# Altium schematic sheet 0160_PCH RAILS.SchDoc
size 848 x 558 mm
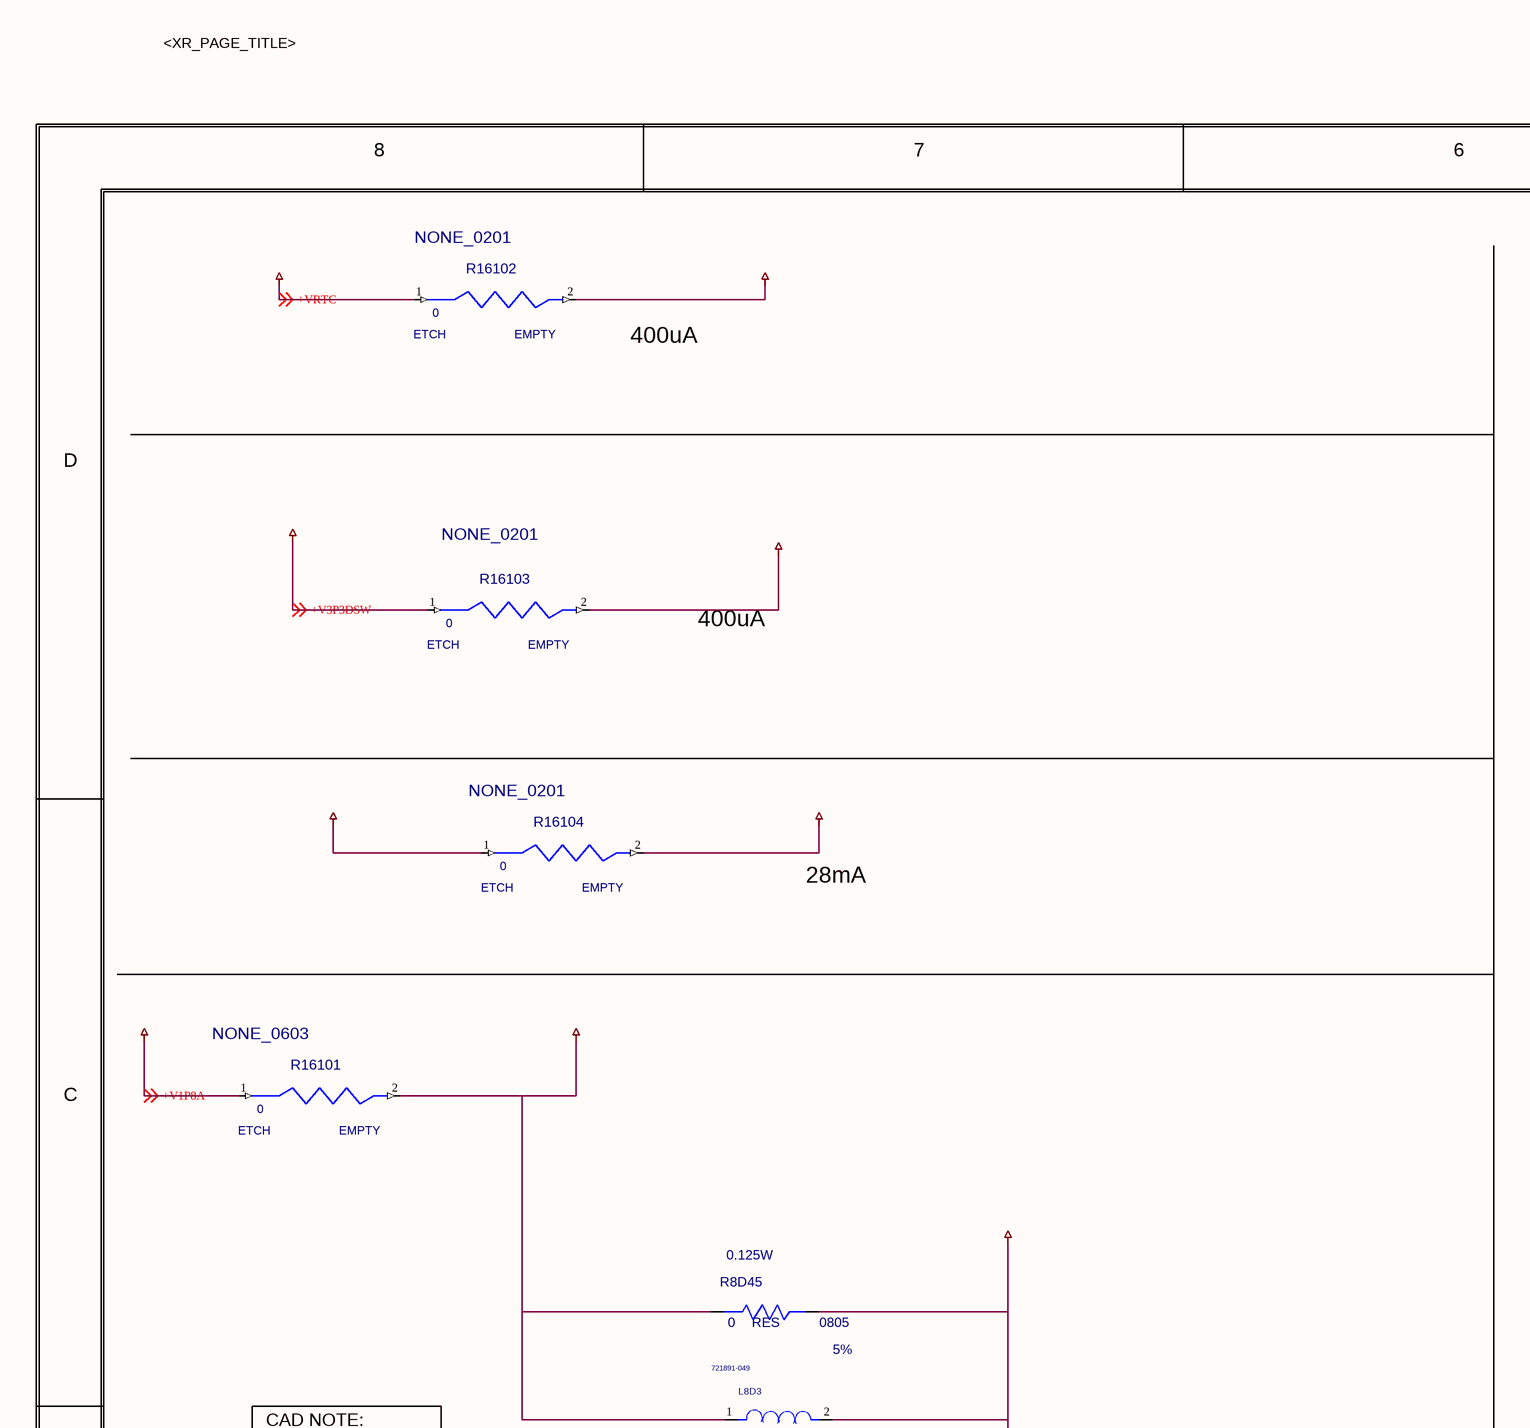
[diagram p0: 0160_PCH RAILS.SchDoc, top left]
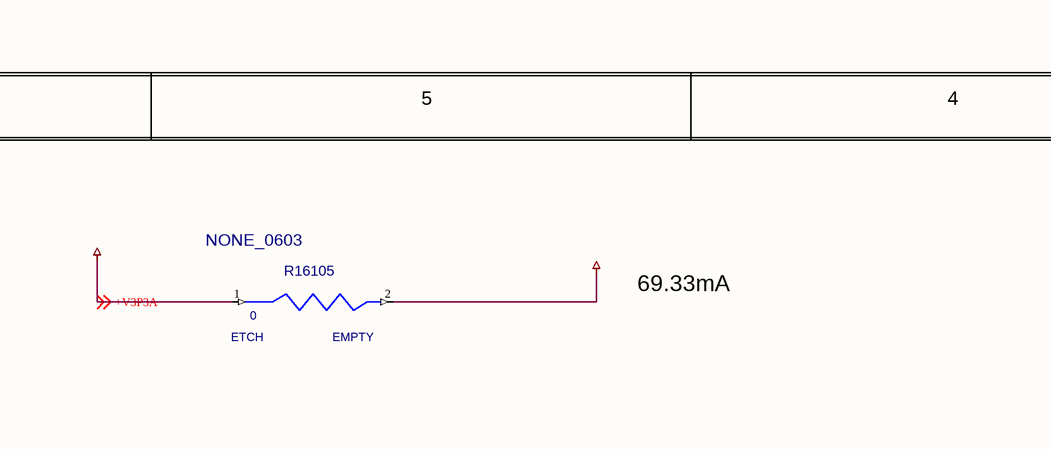
[diagram p1: 0160_PCH RAILS.SchDoc, top middle]
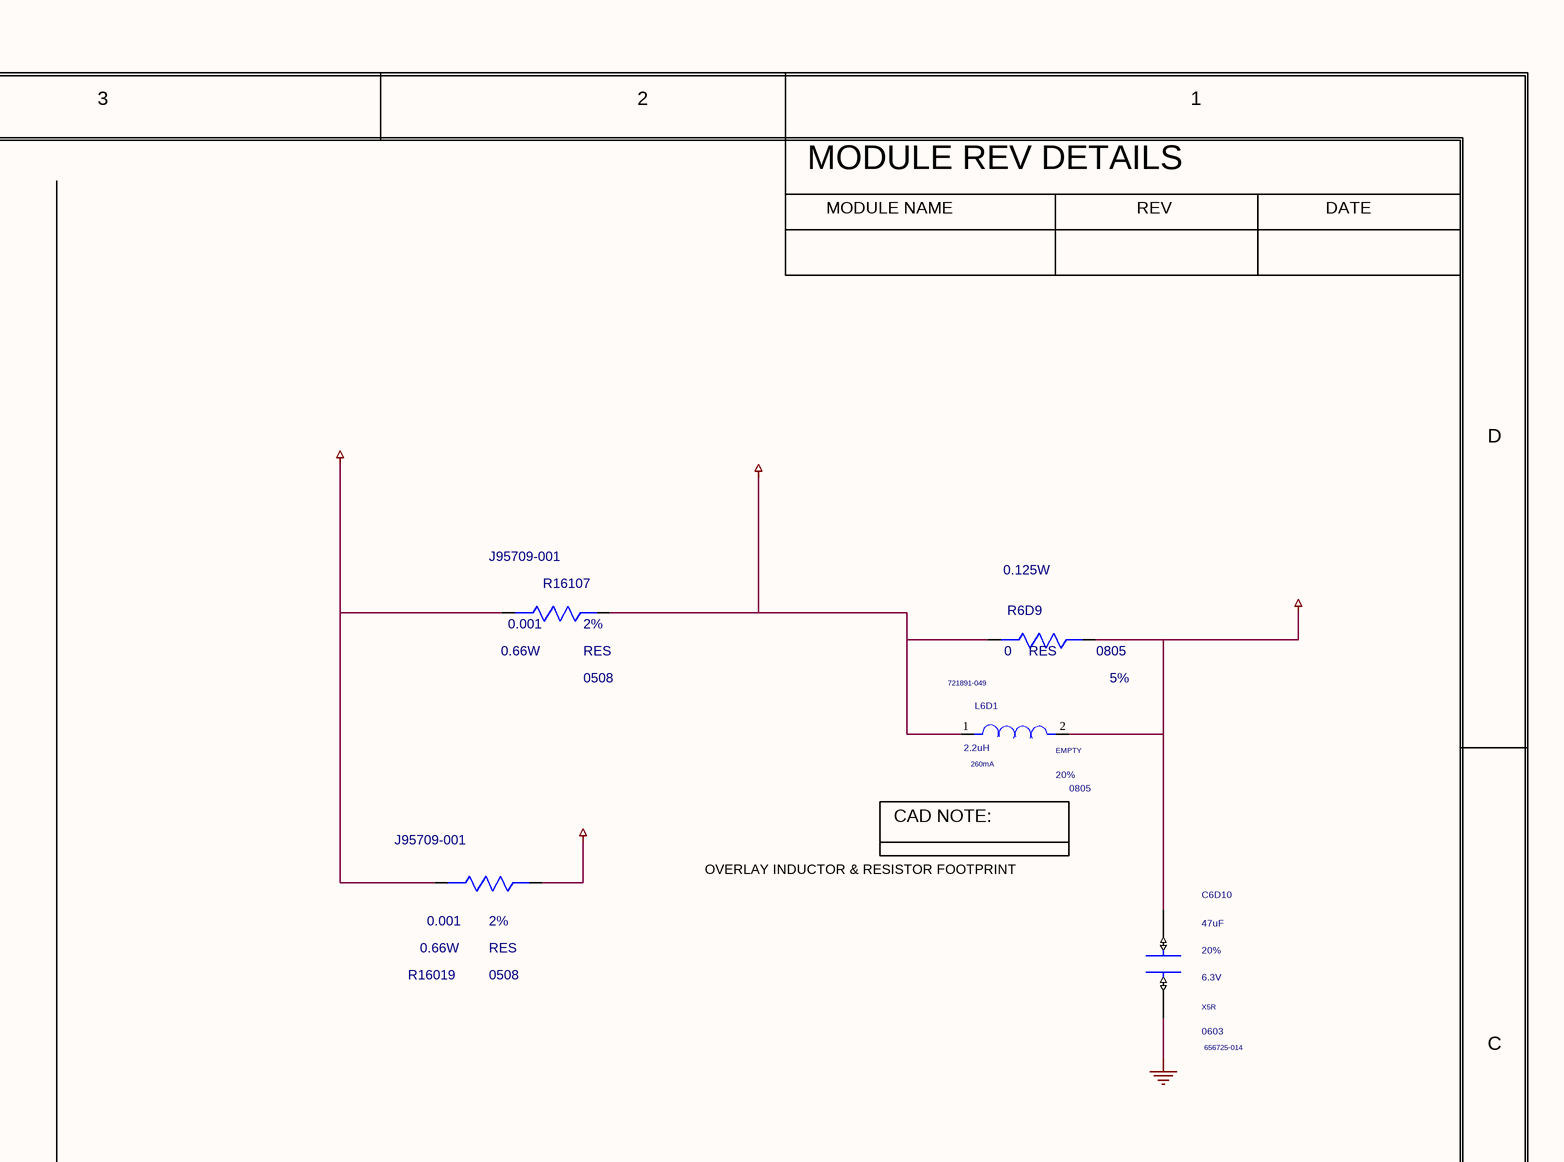
[diagram p2: 0160_PCH RAILS.SchDoc, top right]
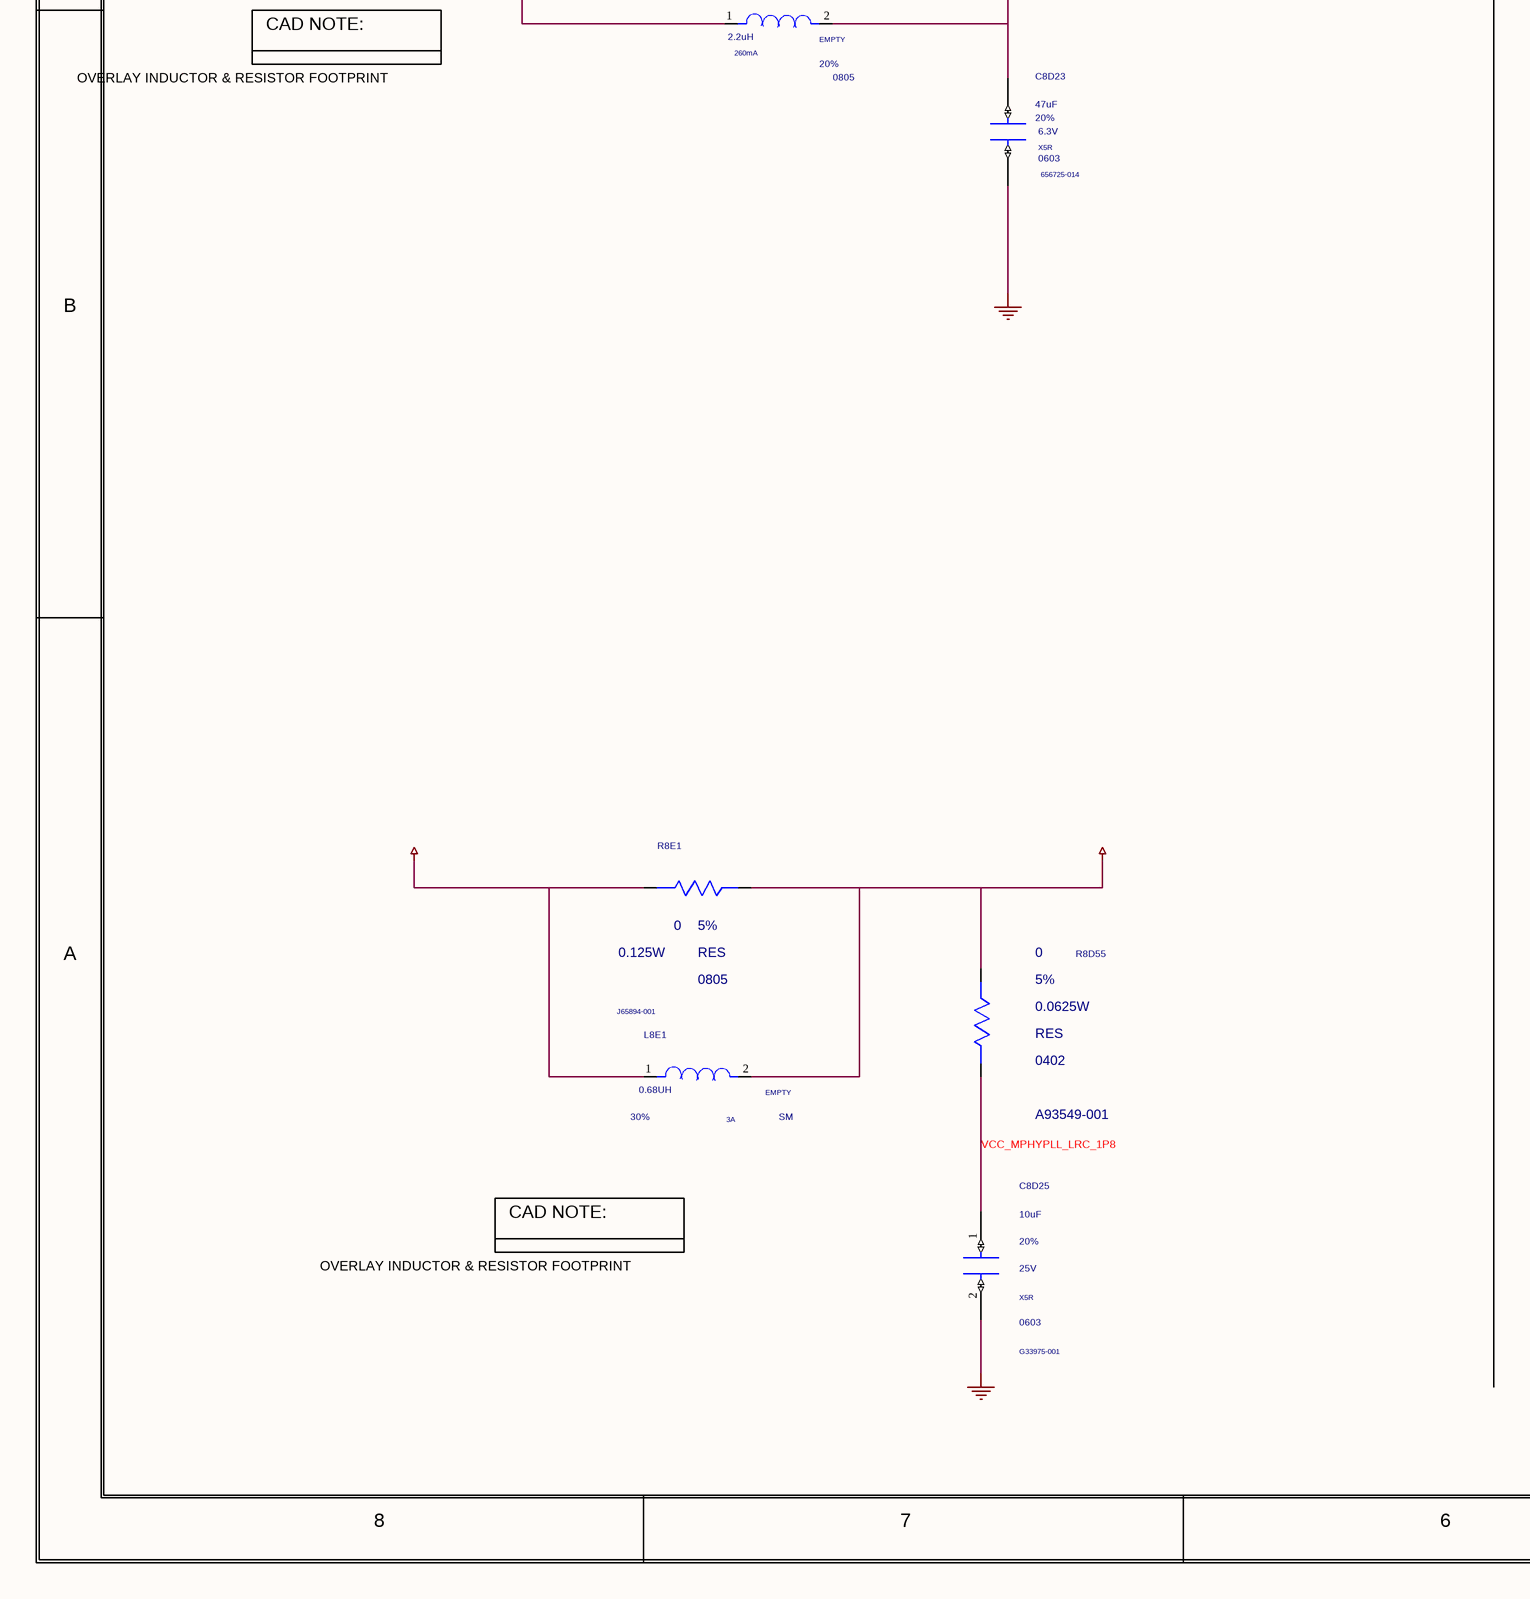
[diagram p3: 0160_PCH RAILS.SchDoc, bottom left]
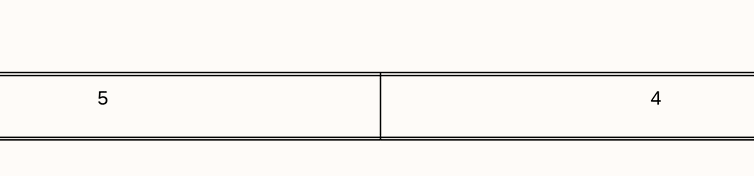
[diagram p4: 0160_PCH RAILS.SchDoc, bottom middle]
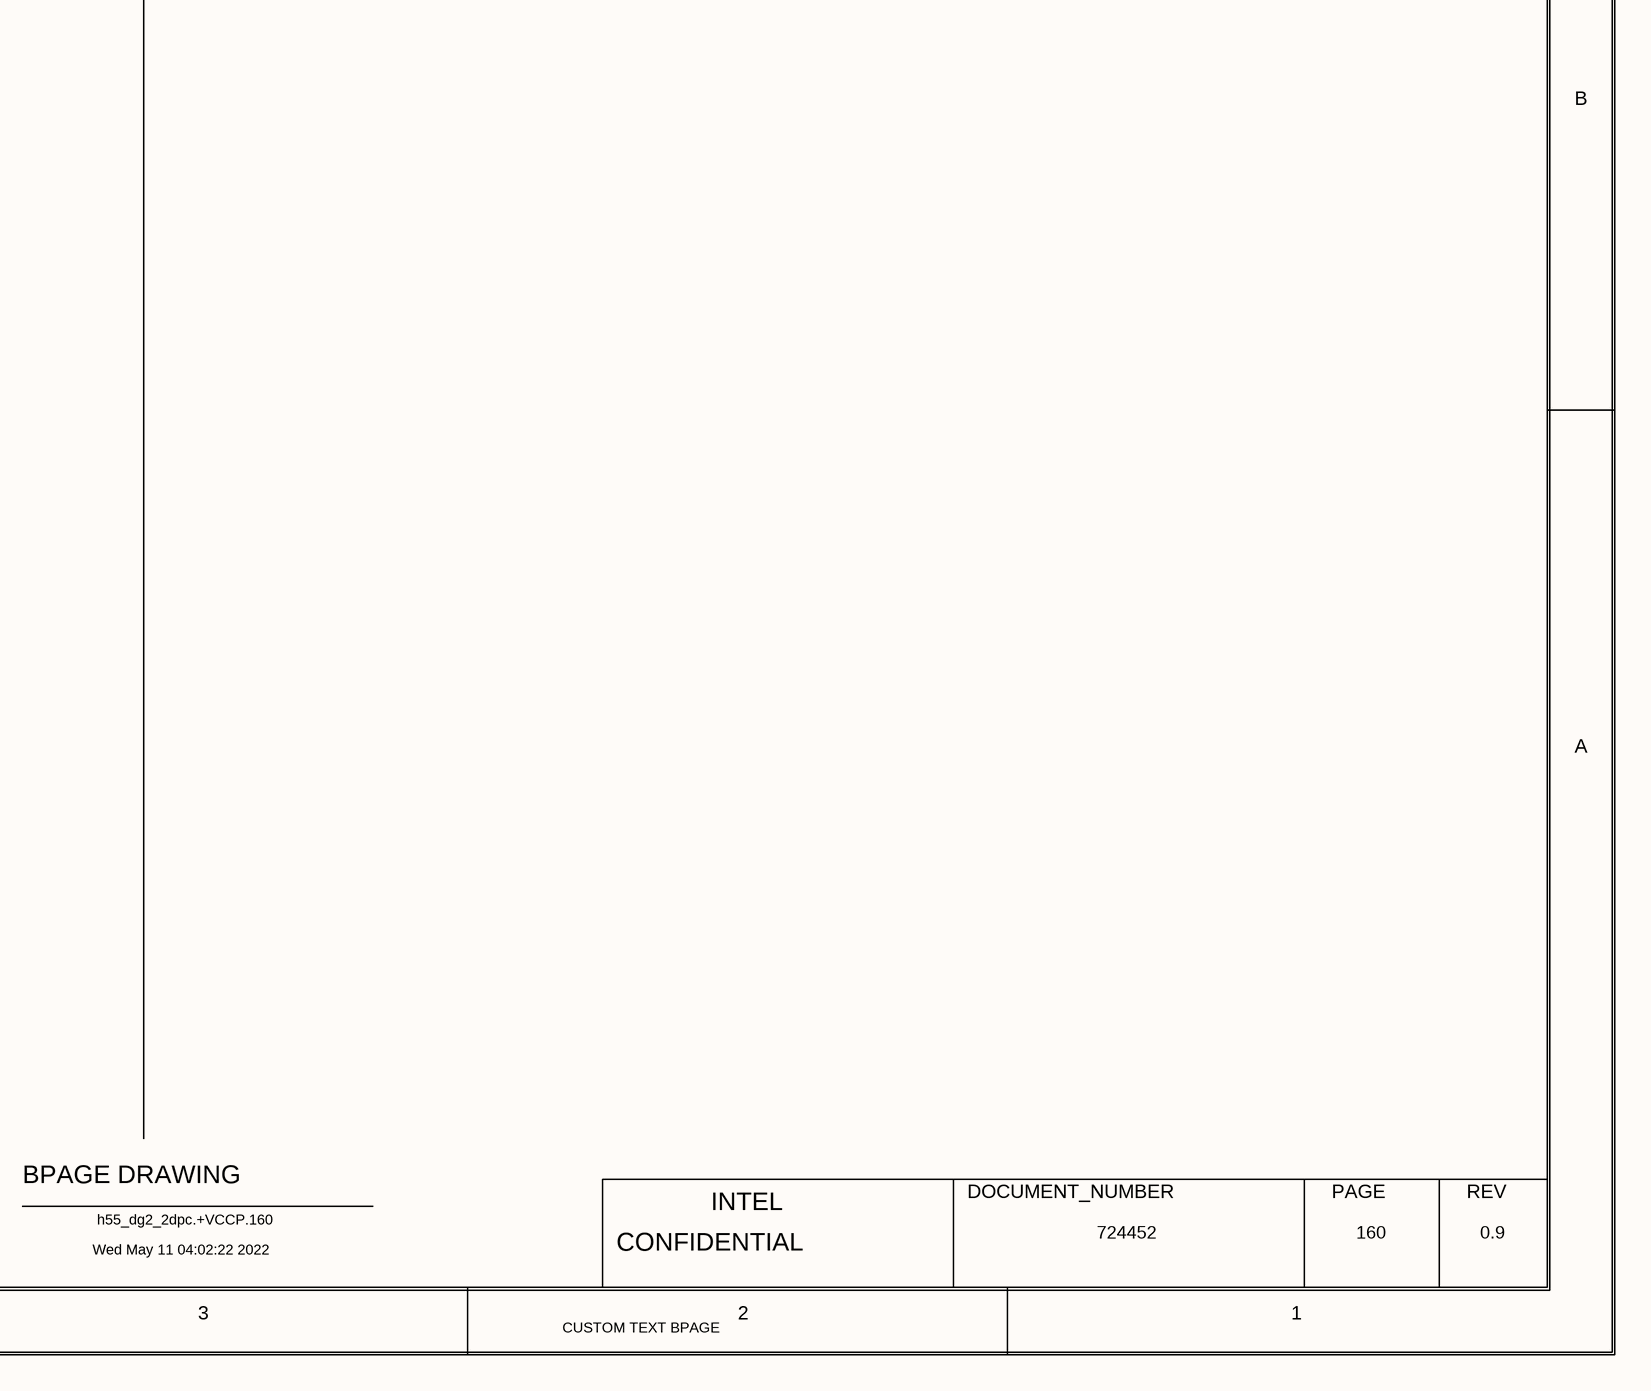
[diagram p5: 0160_PCH RAILS.SchDoc, bottom right]

## Parts
C6D10  47uF  MATERIAL: X5R  PACK_TYPE: 0603  PART_NUMBER: 656725-014  TOLERANCE: 20%  VOLTAGE: 6.3V  [TK0_SM0603_1800X1000_MA]
C8D23  47uF  MATERIAL: X5R  PACK_TYPE: 0603  PART_NUMBER: 656725-014  TOLERANCE: 20%  VOLTAGE: 6.3V  [TK0_SM0603_1800X1000_MA]
C8D25  10uF  MATERIAL: X5R  PACK_TYPE: 0603  PART_NUMBER: G33975-001  TOLERANCE: 20%  VOLTAGE: 25V  [SMC0603IA]
L6D1  2.2uH  CURRENT: 260mA  MATERIAL: EMPTY  PACK_TYPE: 0805  PART_NUMBER: 721891-049  TOLERANCE: 20%  [TK0_SMI_2200X1450_MA]
L8D3  2.2uH  CURRENT: 260mA  MATERIAL: EMPTY  PACK_TYPE: 0805  PART_NUMBER: 721891-049  TOLERANCE: 20%  [TK0_SMI_2200X1450_MA]
L8E1  0.68UH  CURRENT: 3A  MATERIAL: EMPTY  PACK_TYPE: SM  PART_NUMBER: J65894-001  TOLERANCE: 30%  [TK0_SM_2700X2200_MC]
R6D9  0  MATERIAL: RES  PACK_TYPE: 0805  TOLERANCE: 5%  WATTAGE: 0.125W  [CTK2_SM0805_2200X1400_MA]
R8D45  0  MATERIAL: RES  PACK_TYPE: 0805  TOLERANCE: 5%  WATTAGE: 0.125W  [CTK2_SM0805_2200X1400_MA]
R8D55  0  MATERIAL: RES  PACK_TYPE: 0402  PART_NUMBER: A93549-001  TOLERANCE: 5%  WATTAGE: 0.0625W  [CTK2_SM0402_1100X550_MA]
R8E1  0  MATERIAL: RES  PACK_TYPE: 0805  TOLERANCE: 5%  WATTAGE: 0.125W  [CTK2_SM0805_2200X1400_MA]
R16019  0.001  MATERIAL: RES  PACK_TYPE: 0508  PART_NUMBER: J95709-001  TOLERANCE: 2%  WATTAGE: 0.66W  [CTK0_SM0508_1350X2150_MA_MR]
R16101  0  MATERIAL: EMPTY  PACK_TYPE: ETCH  PART_NUMBER: NONE_0603  [SHORTING_RES_0603]
R16102  0  MATERIAL: EMPTY  PACK_TYPE: ETCH  PART_NUMBER: NONE_0201  [SHORTING_RES_0201]
R16103  0  MATERIAL: EMPTY  PACK_TYPE: ETCH  PART_NUMBER: NONE_0201  [SHORTING_RES_0201]
R16104  0  MATERIAL: EMPTY  PACK_TYPE: ETCH  PART_NUMBER: NONE_0201  [SHORTING_RES_0201]
R16105  0  MATERIAL: EMPTY  PACK_TYPE: ETCH  PART_NUMBER: NONE_0603  [SHORTING_RES_0603]
R16107  0.001  MATERIAL: RES  PACK_TYPE: 0508  PART_NUMBER: J95709-001  TOLERANCE: 2%  WATTAGE: 0.66W  [CTK0_SM0508_1350X2150_MA_MR]

## Nets
+V0P82A: R16019.1(A) R16107.1(A)
+V1P05A_PCH: R16104.1(AGND)
+V1P8A: R16101.1(AGND) ; off-sheet +V1P8A
+V3P3A: R16105.1(AGND) ; off-sheet +V3P3A
+V3P3DSW: R16103.1(AGND) ; off-sheet +V3P3DSW
+VCC_MPHYPLL_1P8: L8E1.2(INB) R8D55.1(A) R8E1.2(B)
+VCCA_0P82: C6D10.1(A) L6D1.2(INB) R6D9.2(B)
+VCCA_XTAL_PLL_1P8: C8D23.1(A) L8D3.2(INB) R8D45.2(B)
+VCCHSIO_0P82: R16019.2(B)
+VCCPDSW_3P3: R16103.2(GND)
+VCCPRIM_1P05: R16104.2(GND)
+VCCPRIM_1P8: L8D3.1(INA) L8E1.1(INA) R8D45.1(A) R8E1.1(A) R16101.2(GND)
+VCCPRIM_3P3: R16105.2(GND)
+VCCPRIMCORE_0P82: L6D1.1(INA) R6D9.1(A) R16107.2(B)
+VCCPRTC_3P3: R16102.2(GND)
+VRTC: R16102.1(AGND) ; off-sheet +VRTC
GND: C6D10.2(B) C8D23.2(B) C8D25.2(B)
VCC_MPHYPLL_LRC_1P8: C8D25.1(A) R8D55.2(B)

## Notes on the sheet
- <XR_PAGE_TITLE>
- 8
- 7
- 6
- 5
- 4
- 3
- 2
- 1
- MODULE REV DETAILS
- MODULE NAME
- REV
- DATE
- 400uA
- 69.33mA
- D
- 28mA
- OVERLAY INDUCTOR & RESISTOR FOOTPRINT
- CAD NOTE:
- C
- B
- A
- BPAGE DRAWING
- INTEL
- DOCUMENT_NUMBER
- PAGE
- Wed May 11 04:02:22 2022
- h55_dg2_2dpc.+VCCP.160
- CONFIDENTIAL
- 724452
- 160
- 0.9
- CUSTOM TEXT BPAGE

## Library data of the parts
C6D10 = CAP_2: CDS_PHYS_PART_NAME: CAP_2_0603-656725-014,X5R,47UF,6.3V,20%,TK0,GENERIC; BOM_USE: NA; CDS_LMAN_SYM_OUTLINE: -50,50,50,-50; FP_TECH: TK0; IP: GENERIC; ROOM: NONE; OriginalSymbolOrigin: (-50,25); XY: (-1225,4375); VER: 1; ROT: 0; PHYS_PAGE: 160; LOCATION: C6D10; DRAWING: @RVP1_ADL_SB_ADP_S_DDR5_SODIMM_2DPC_LIB.H55_DG2_2DPC(SCH_1):PAGE529; CDS_LIB: discrete_2; VARIANT: ?; PCB Footprint: TK0_SM0603_1800X1000_MA; SEC_TYPE: 0603; CHIPS_PART_NAME: CAP_2; CDS_PART_NAME: CAP_2_0603-656725-014,X5R,47UF,6.3V,20%,TK0,GENERIC; CDS_LOCATION: C6D10; ASI_MODEL: 656725-014
C8D23 = CAP_2: CDS_PHYS_PART_NAME: CAP_2_0603-656725-014,X5R,47UF,6.3V,20%,TK0,GENERIC; BOM_USE: NA; CDS_LMAN_SYM_OUTLINE: -50,50,50,-50; FP_TECH: TK0; IP: GENERIC; ROOM: NONE; OriginalSymbolOrigin: (-50,25); XY: (-7000,3425); VER: 1; ROT: 0; PHYS_PAGE: 160; LOCATION: C8D23; DRAWING: @RVP1_ADL_SB_ADP_S_DDR5_SODIMM_2DPC_LIB.H55_DG2_2DPC(SCH_1):PAGE529; CDS_LIB: discrete_2; VARIANT: ?; PCB Footprint: TK0_SM0603_1800X1000_MA; SEC_TYPE: 0603; CHIPS_PART_NAME: CAP_2; CDS_PART_NAME: CAP_2_0603-656725-014,X5R,47UF,6.3V,20%,TK0,GENERIC; CDS_LOCATION: C8D23; ASI_MODEL: 656725-014
C8D25 = CAP: CDS_PHYS_PART_NAME: CAP_0603-G33975-001,X5R,10UF,25V,20%,LPDB,GENERIC; OriginalSymbolOrigin: (-50,25); XY: (-7050,1325); VER: 1; ROT: 0; PHYS_PAGE: 160; LOCATION: C8D25; IP: GENERIC; FP_TECH: LPDB; DRAWING: @RVP1_ADL_SB_ADP_S_DDR5_SODIMM_2DPC_LIB.H55_DG2_2DPC(SCH_1):PAGE529; CDS_LIB: discrete; PCB Footprint: SMC0603IA; CHIPS_PART_NAME: CAP; CDS_PART_NAME: CAP_0603-G33975-001,X5R,10UF,25V,20%,LPDB,GENERIC; CDS_LOCATION: C8D25; ASI_MODEL: G33975-001
L6D1 = INDUCTOR_2: CDS_PHYS_PART_NAME: INDUCTOR_2_0805-721891-049,EMPTY,2.2UH,20%,260MA,TK0,GENERIC; BOM_USE: NA; CDS_LMAN_SYM_OUTLINE: -100,50,100,-50; FP_TECH: TK0; IP: GENERIC; ROOM: NONE; OriginalSymbolOrigin: (-75,25); XY: (-1500,4800); VER: 1; ROT: 0; PHYS_PAGE: 160; LOCATION: L6D1; DRAWING: @RVP1_ADL_SB_ADP_S_DDR5_SODIMM_2DPC_LIB.H55_DG2_2DPC(SCH_1):PAGE529; CDS_LIB: discrete_2; VARIANT: ?; PCB Footprint: TK0_SMI_2200X1450_MA; SEC_TYPE: 0805; CHIPS_PART_NAME: INDUCTOR_2; CDS_PART_NAME: INDUCTOR_2_0805-721891-049,EMPTY,2.2UH,20%,260MA,TK0,GENERIC; CDS_LOCATION: L6D1; ASI_MODEL: 721891-049
L8D3 = INDUCTOR_2: CDS_PHYS_PART_NAME: INDUCTOR_2_0805-721891-049,EMPTY,2.2UH,20%,260MA,TK0,GENERIC; BOM_USE: NA; CDS_LMAN_SYM_OUTLINE: -100,50,100,-50; FP_TECH: TK0; IP: GENERIC; ROOM: NONE; OriginalSymbolOrigin: (-75,25); XY: (-7425,3625); VER: 1; ROT: 0; PHYS_PAGE: 160; LOCATION: L8D3; DRAWING: @RVP1_ADL_SB_ADP_S_DDR5_SODIMM_2DPC_LIB.H55_DG2_2DPC(SCH_1):PAGE529; CDS_LIB: discrete_2; VARIANT: ?; PCB Footprint: TK0_SMI_2200X1450_MA; SEC_TYPE: 0805; CHIPS_PART_NAME: INDUCTOR_2; CDS_PART_NAME: INDUCTOR_2_0805-721891-049,EMPTY,2.2UH,20%,260MA,TK0,GENERIC; CDS_LOCATION: L8D3; ASI_MODEL: 721891-049
L8E1 = INDUCTOR_2: CDS_PHYS_PART_NAME: INDUCTOR_2_SM-J65894-001,EMPTY,0.68UH,30%,3A,TK0,GENERIC; BOM_USE: NA; CDS_LMAN_SYM_OUTLINE: -100,50,100,-50; FP_TECH: TK0; IP: GENERIC; ROOM: NONE; OriginalSymbolOrigin: (-75,25); XY: (-7575,1675); VER: 1; ROT: 0; PHYS_PAGE: 160; LOCATION: L8E1; DRAWING: @RVP1_ADL_SB_ADP_S_DDR5_SODIMM_2DPC_LIB.H55_DG2_2DPC(SCH_1):PAGE529; CDS_LIB: discrete_2; VARIANT: ?; PCB Footprint: TK0_SM_2700X2200_MC; SEC_TYPE: SM; CHIPS_PART_NAME: INDUCTOR_2; CDS_PART_NAME: INDUCTOR_2_SM-J65894-001,EMPTY,0.68UH,30%,3A,TK0,GENERIC; CDS_LOCATION: L8E1; ASI_MODEL: J65894-001
R6D9 = C_RES#1: PART_NUMBER: A93552-002; CHIPS_PART_NAME: C_RES; CDS_PHYS_PART_NAME: C_RES_0805-A93552-002,RES,0,5%,0.125W,TK2,GENERIC; CDS_LMAN_SYM_OUTLINE: -50,50,50,-50; FP_TECH: TK2; IP: GENERIC; ROOM: NONE; OriginalSymbolOrigin: (-75,25); XY: (-1450,4975); VER: 1; PHYS_PAGE: 160; LOCATION: R6D9; DRAWING: @RVP1_ADL_SB_ADP_S_DDR5_SODIMM_2DPC_LIB.H55_DG2_2DPC(SCH_1):PAGE529; CDS_LIB: c_discrete; VARIANT: ?; PCB Footprint: CTK2_SM0805_2200X1400_MA; ROT: 0; CDS_PART_NAME: C_RES_0805-A93552-002,RES,0,5%,0.125W,TK2,GENERIC; CDS_LOCATION: R6D9; ASI_MODEL: A93552-002
R8D45 = C_RES#1: PART_NUMBER: A93552-002; CHIPS_PART_NAME: C_RES; CDS_PHYS_PART_NAME: C_RES_0805-A93552-002,RES,0,5%,0.125W,TK2,GENERIC; CDS_LMAN_SYM_OUTLINE: -50,50,50,-50; FP_TECH: TK2; IP: GENERIC; ROOM: NONE; OriginalSymbolOrigin: (-75,25); XY: (-7450,3825); VER: 1; PHYS_PAGE: 160; LOCATION: R8D45; DRAWING: @RVP1_ADL_SB_ADP_S_DDR5_SODIMM_2DPC_LIB.H55_DG2_2DPC(SCH_1):PAGE529; CDS_LIB: c_discrete; VARIANT: ?; PCB Footprint: CTK2_SM0805_2200X1400_MA; ROT: 0; CDS_PART_NAME: C_RES_0805-A93552-002,RES,0,5%,0.125W,TK2,GENERIC; CDS_LOCATION: R8D45; ASI_MODEL: A93552-002
R8D55 = C_RES: CDS_PHYS_PART_NAME: C_RES_0402-A93549-001,RES,0,5%,0.0625W,TK2,GENERIC; CDS_LMAN_SYM_OUTLINE: -50,50,50,-50; FP_TECH: TK2; IP: GENERIC; ROOM: NONE; OriginalSymbolOrigin: (-25,75); XY: (-7050,1775); VER: 2; PHYS_PAGE: 160; LOCATION: R8D55; DRAWING: @RVP1_ADL_SB_ADP_S_DDR5_SODIMM_2DPC_LIB.H55_DG2_2DPC(SCH_1):PAGE529; CDS_LIB: c_discrete; VARIANT: ?; PCB Footprint: CTK2_SM0402_1100X550_MA; ROT: 0; CHIPS_PART_NAME: C_RES; CDS_PART_NAME: C_RES_0402-A93549-001,RES,0,5%,0.0625W,TK2,GENERIC; CDS_LOCATION: R8D55; ASI_MODEL: A93549-001
R8E1 = C_RES#1: PART_NUMBER: A93552-002; CHIPS_PART_NAME: C_RES; CDS_PHYS_PART_NAME: C_RES_0805-A93552-002,RES,0,5%,0.125W,TK2,GENERIC; CDS_LMAN_SYM_OUTLINE: -50,50,50,-50; FP_TECH: TK2; IP: GENERIC; ROOM: NONE; OriginalSymbolOrigin: (-75,25); XY: (-7575,2025); VER: 1; PHYS_PAGE: 160; LOCATION: R8E1; DRAWING: @RVP1_ADL_SB_ADP_S_DDR5_SODIMM_2DPC_LIB.H55_DG2_2DPC(SCH_1):PAGE529; CDS_LIB: c_discrete; VARIANT: ?; PCB Footprint: CTK2_SM0805_2200X1400_MA; ROT: 0; CDS_PART_NAME: C_RES_0805-A93552-002,RES,0,5%,0.125W,TK2,GENERIC; CDS_LOCATION: R8E1; ASI_MODEL: A93552-002
R16019 = C_RES#1: CHIPS_PART_NAME: C_RES; CDS_PHYS_PART_NAME: C_RES_0508-J95709-001,RES,0.001,2%,0.66W,TK0,GENERIC; CDS_LMAN_SYM_OUTLINE: -50,50,50,-50; FP_TECH: TK0; IP: GENERIC; ROOM: NONE; OriginalSymbolOrigin: (-75,25); XY: (-2475,4525); VER: 1; ROT: 0; PHYS_PAGE: 160; LOCATION: R16019; DRAWING: @RVP1_ADL_SB_ADP_S_DDR5_SODIMM_2DPC_LIB.H55_DG2_2DPC(SCH_1):PAGE529; CDS_LIB: c_discrete; VARIANT: ?; PCB Footprint: CTK0_SM0508_1350X2150_MA_MR; CDS_PART_NAME: C_RES_0508-J95709-001,RES,0.001,2%,0.66W,TK0,GENERIC; CDS_LOCATION: R16019
R16101 = SHORTING_RES: CDS_PHYS_PART_NAME: SHORTING_RES_ETCH-NONE_0603; CDS_LMAN_SYM_OUTLINE: -100,50,100,-50; OriginalSymbolOrigin: (-125,25); XY: (-8275,4225); VER: 1; PHYS_PAGE: 160; LOCATION: R16101; DRAWING: @RVP1_ADL_SB_ADP_S_DDR5_SODIMM_2DPC_LIB.H55_DG2_2DPC(SCH_1):PAGE529; CDS_LIB: standard_pccg; PCB Footprint: SHORTING_RES_0603; ROT: 0; CHIPS_PART_NAME: SHORTING_RES; CDS_PART_NAME: SHORTING_RES_ETCH-NONE_0603; CDS_LOCATION: R16101
R16102 = SHORTING_RES: CDS_PHYS_PART_NAME: SHORTING_RES_ETCH-NONE_0201; CDS_LMAN_SYM_OUTLINE: -100,50,100,-50; OriginalSymbolOrigin: (-125,25); XY: (-7950,5700); VER: 1; PHYS_PAGE: 160; LOCATION: R16102; DRAWING: @RVP1_ADL_SB_ADP_S_DDR5_SODIMM_2DPC_LIB.H55_DG2_2DPC(SCH_1):PAGE529; CDS_LIB: standard_pccg; PCB Footprint: SHORTING_RES_0201; ROT: 0; CHIPS_PART_NAME: SHORTING_RES; CDS_PART_NAME: SHORTING_RES_ETCH-NONE_0201; CDS_LOCATION: R16102
R16103 = SHORTING_RES: CDS_PHYS_PART_NAME: SHORTING_RES_ETCH-NONE_0201; CDS_LMAN_SYM_OUTLINE: -100,50,100,-50; OriginalSymbolOrigin: (-125,25); XY: (-7925,5125); VER: 1; PHYS_PAGE: 160; LOCATION: R16103; DRAWING: @RVP1_ADL_SB_ADP_S_DDR5_SODIMM_2DPC_LIB.H55_DG2_2DPC(SCH_1):PAGE529; CDS_LIB: standard_pccg; PCB Footprint: SHORTING_RES_0201; ROT: 0; CHIPS_PART_NAME: SHORTING_RES; CDS_PART_NAME: SHORTING_RES_ETCH-NONE_0201; CDS_LOCATION: R16103
R16104 = SHORTING_RES: CDS_PHYS_PART_NAME: SHORTING_RES_ETCH-NONE_0201; CDS_LMAN_SYM_OUTLINE: -100,50,100,-50; OriginalSymbolOrigin: (-125,25); XY: (-7825,4675); VER: 1; PHYS_PAGE: 160; LOCATION: R16104; DRAWING: @RVP1_ADL_SB_ADP_S_DDR5_SODIMM_2DPC_LIB.H55_DG2_2DPC(SCH_1):PAGE529; CDS_LIB: standard_pccg; PCB Footprint: SHORTING_RES_0201; ROT: 0; CHIPS_PART_NAME: SHORTING_RES; CDS_PART_NAME: SHORTING_RES_ETCH-NONE_0201; CDS_LOCATION: R16104
R16105 = SHORTING_RES: CDS_PHYS_PART_NAME: SHORTING_RES_ETCH-NONE_0603; CDS_LMAN_SYM_OUTLINE: -100,50,100,-50; OriginalSymbolOrigin: (-125,25); XY: (-5375,5600); VER: 1; PHYS_PAGE: 160; LOCATION: R16105; DRAWING: @RVP1_ADL_SB_ADP_S_DDR5_SODIMM_2DPC_LIB.H55_DG2_2DPC(SCH_1):PAGE529; CDS_LIB: standard_pccg; PCB Footprint: SHORTING_RES_0603; ROT: 0; CHIPS_PART_NAME: SHORTING_RES; CDS_PART_NAME: SHORTING_RES_ETCH-NONE_0603; CDS_LOCATION: R16105
R16107 = C_RES#1: CHIPS_PART_NAME: C_RES; CDS_PHYS_PART_NAME: C_RES_0508-J95709-001,RES,0.001,2%,0.66W,TK0,GENERIC; CDS_LMAN_SYM_OUTLINE: -50,50,50,-50; FP_TECH: TK0; IP: GENERIC; ROOM: NONE; OriginalSymbolOrigin: (-75,25); XY: (-2350,5025); VER: 1; ROT: 0; PHYS_PAGE: 160; LOCATION: R16107; DRAWING: @RVP1_ADL_SB_ADP_S_DDR5_SODIMM_2DPC_LIB.H55_DG2_2DPC(SCH_1):PAGE529; CDS_LIB: c_discrete; VARIANT: ?; PCB Footprint: CTK0_SM0508_1350X2150_MA_MR; CDS_PART_NAME: C_RES_0508-J95709-001,RES,0.001,2%,0.66W,TK0,GENERIC; CDS_LOCATION: R16107